# Altium schematic sheet Trepanat_Power.SchDoc
size 420 x 297 mm; DocumentNumber: ПРО 2018.001 Э3; SheetNumber: 3; Format: A3
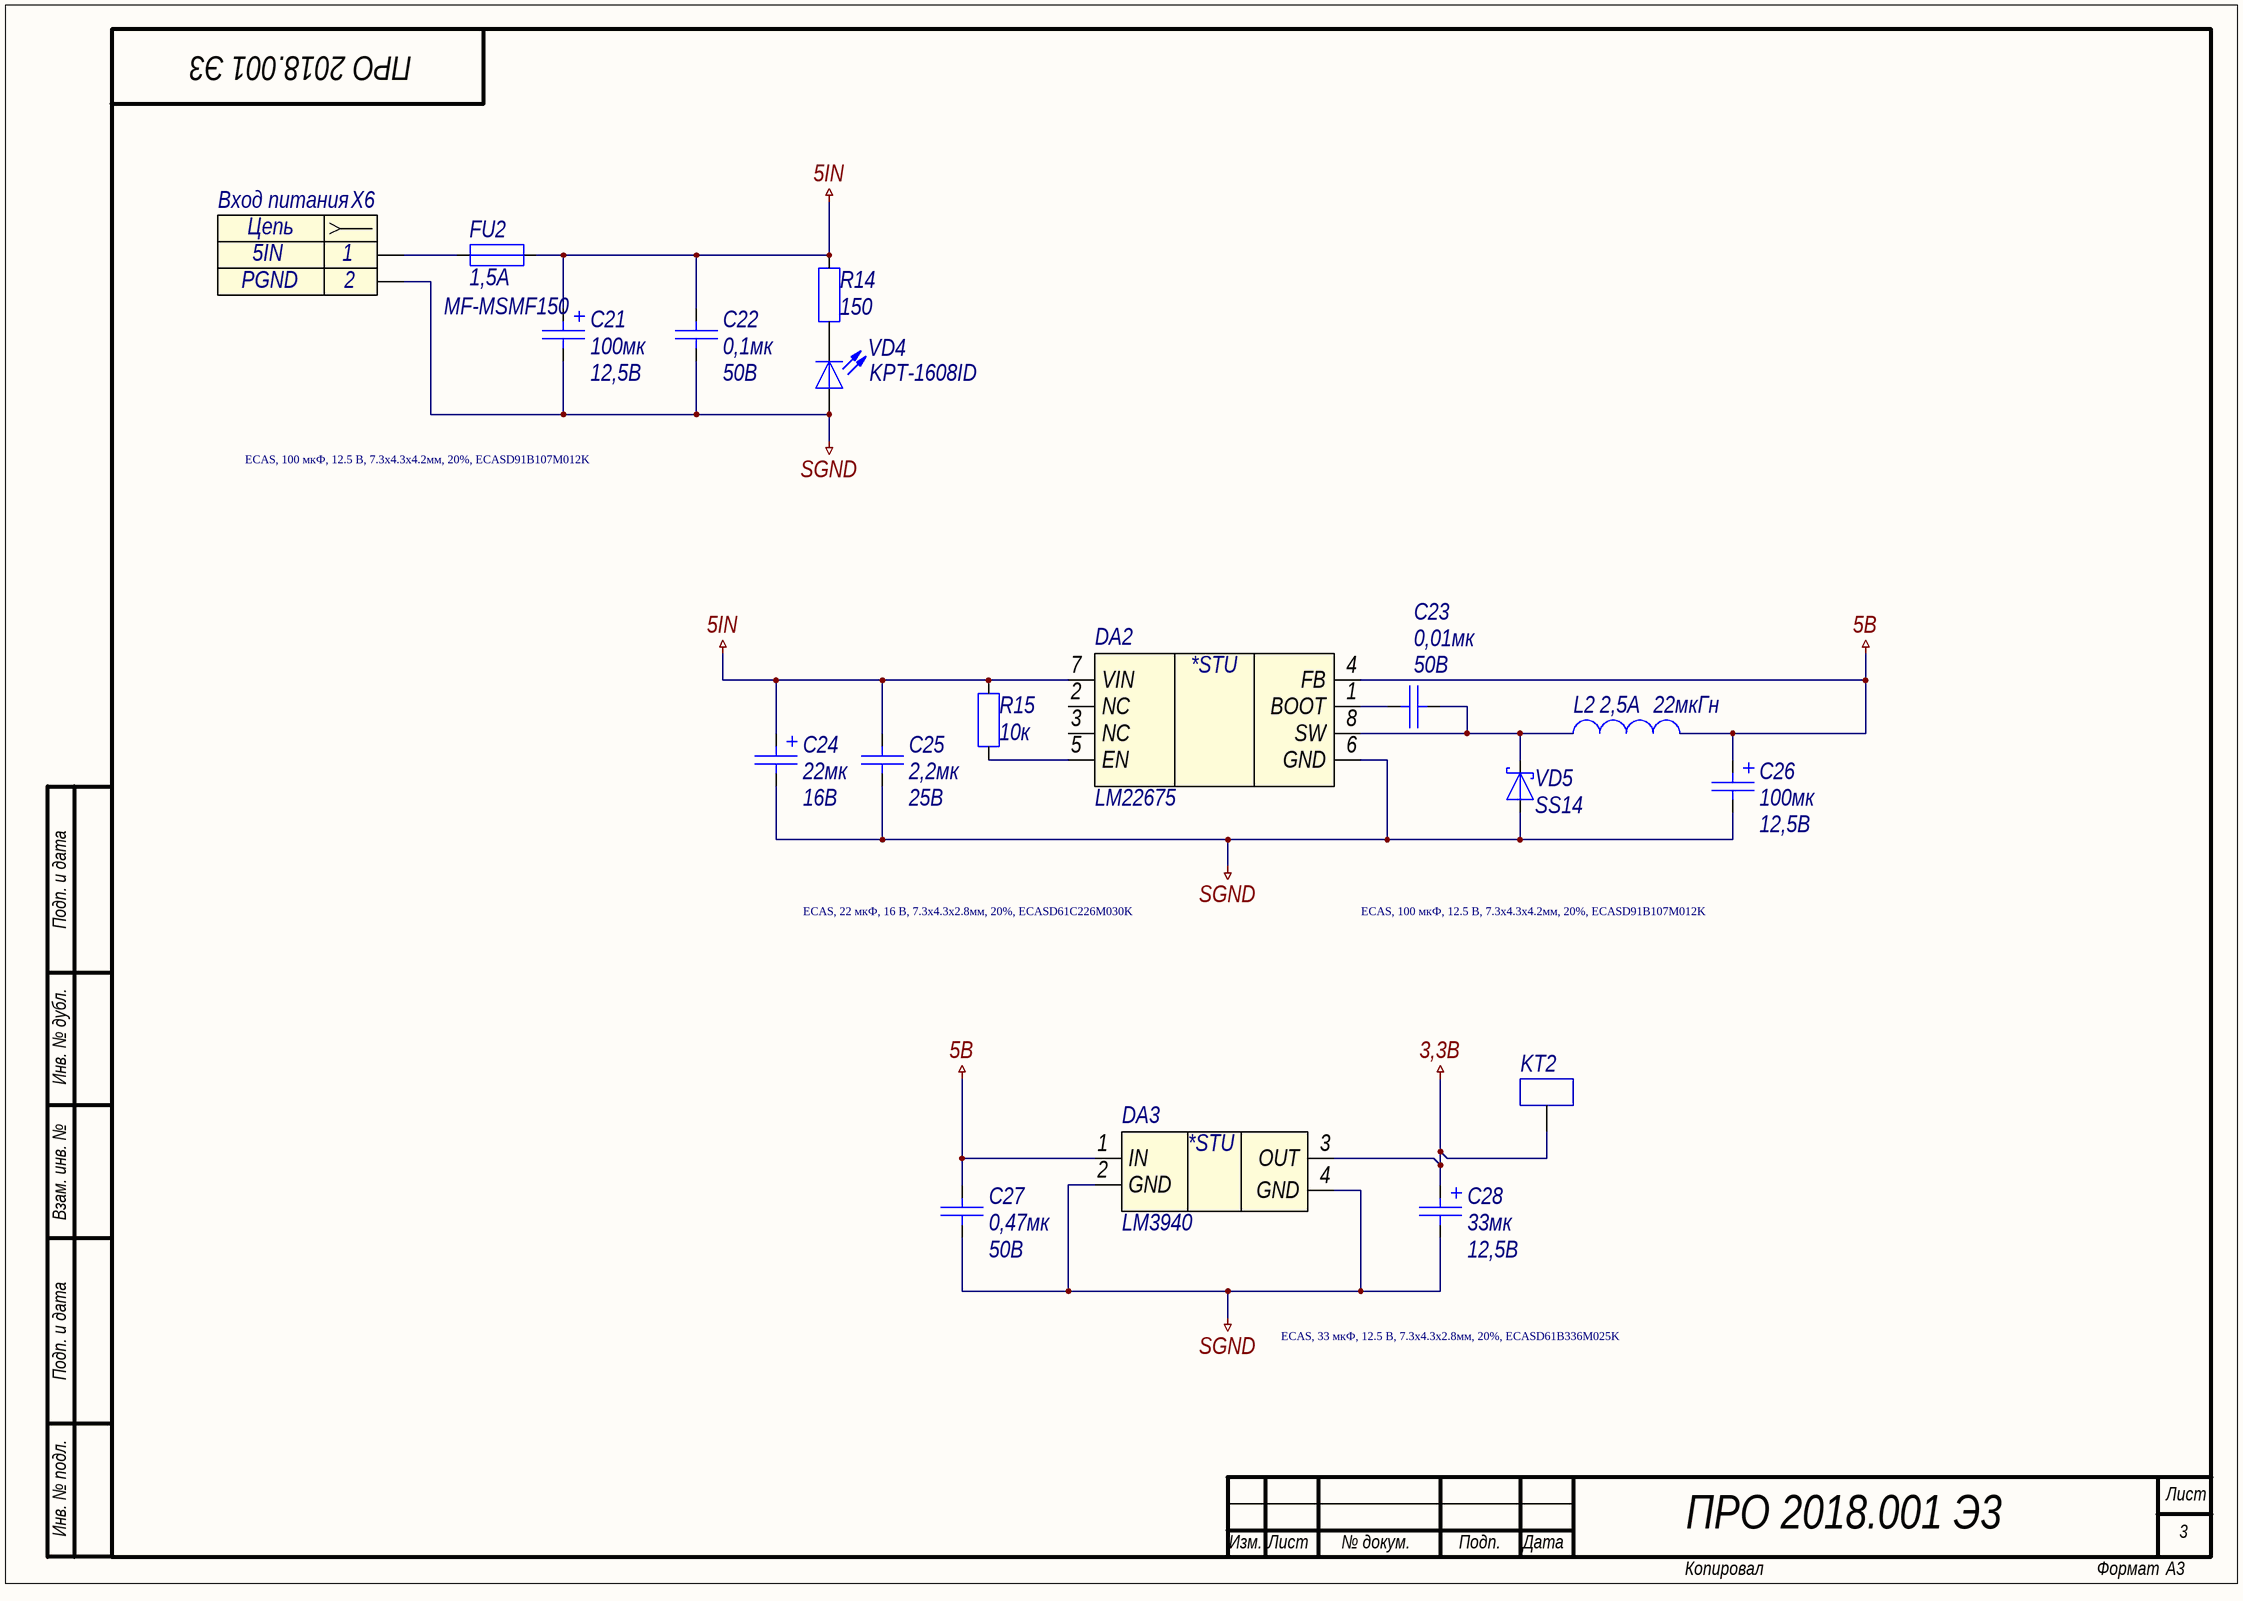
[diagram p0: Trepanat_Power.SchDoc]

## Parts
C21  Voltage: 12,5В  [TANTAL CASE D]  (hidden comment: 100мк)
C22  0,1мк  Voltage: 50В  [C0805]
C23  0,01мк  Voltage: 50В  [C0805]
C24  Voltage: 16В  [TANTAL CASE D]  (hidden comment: 22мк)
C25  2,2мк  Voltage: 25В  [C0805]
C26  Voltage: 12,5В  [TANTAL CASE D]  (hidden comment: 100мк)
C27  0,47мк  Voltage: 50В  [C0805]
C28  Voltage: 12,5В  [TANTAL CASE D]  (hidden comment: 33мк)
DA2  LM22675  [SO PowerPAD-8]
DA3  LM3940  [TO-263-3]
FU2  value 1,5A  [R1812]  (hidden comment: MF-MSMF150)
KT2  KT  [КТ]  (value not drawn)
L2  Imax: 2,5А  [IND_B82464G4223M]  (hidden comment: 22мкГн)
R14  150  [R0805]
R15  10к  [R0805]
VD4  KPT-1608ID  [D0603]
VD5  SS14  [SMA]
X6  Вход питания  [DT-128V-2]

## Nets
3,3B: C28.1 DA3.3(OUT) KT2.1
5B: C26.1 C27.2 DA2.4(FB) DA3.1(IN) L2.2
5IN: C21.1 C22.2 C24.1 C25.2 DA2.7(VIN) FU2.2 R14.1 R15.1
SGND: C21.2 C22.1 C24.2 C25.1 C26.2 C27.1 C28.2 DA2.6(GND) DA3.2(GND) DA3.4(GND) VD4.2(A) VD5.2(A) X6.2
NetC23_1: C23.1 DA2.8(SW) L2.1 VD5.1(K)
NetC23_2: C23.2 DA2.1(BOOT)
NetDA2_5: DA2.5(EN) R15.2
NetFU2_1: FU2.1 X6.1
NetR14_2: R14.2 VD4.1(K)

Not connected (* = marked no-connect by the designer): DA2 2(NC) 3(NC)

## Notes on the sheet
- ECAS, 100 мкФ, 12.5 В, 7.3х4.3х4.2мм, 20%, ECASD91B107M012K
- Подп. и дата
- ECAS, 22 мкФ, 16 В, 7.3х4.3х2.8мм, 20%, ECASD61C226M030K
- Инв. № дубл.
- Взам. инв. №
- ECAS, 33 мкФ, 12.5 В, 7.3х4.3х2.8мм, 20%, ECASD61B336M025K
- Инв. № подл.
- Лист
- Изм.
- № докум.
- Подп.
- Дата
- Копировал
- Формат
- (in symbol Header_2_sct) Цепь
- (in symbol LM3940) *STU
- (in symbol LM22675) *STU

## Library data of the parts
C21 C24 C26 C28 = Capacitor_pol: Конденсатор полярный
  C21 C26: Value: 100мк
  C24: Value: 22мк
  C28: Value: 33мк
C22 C23 C25 C27 = Capacitor: Конденсатор
  C22: Value: 0,1мк
  C23: Value: 0,01мк
  C25: Value: 2,2мк
  C27: Value: 0,47мк
DA2 = LM22675: 3-A Step-Down Voltage Regulator
DA3 = LM3940: Low-Dropout Regulator for 5-V to 3.3-V Conversion
FU2 = Fuse: Предохранитель; Name: MF-MSMF150
KT2 = KT: Контрольная точка
L2 = Inductor: Катушка индуктивности; Value: 22мкГн
R14 R15 = Resistor: Резистор
  R14: Value: 150
  R15: Value: 10к
VD4 = LED_L: Светодиод; Name: KPT-1608ID
VD5 = DiodeSchottky: Диод Шоттки; Name: SS14
X6 = Header_2_sct: Разъем - 2 конт. розетка; Contact_1: 5IN; Contact_2: PGND; Name: Вход питания